# EAGLE design gm (EAGLE 9.6.2)
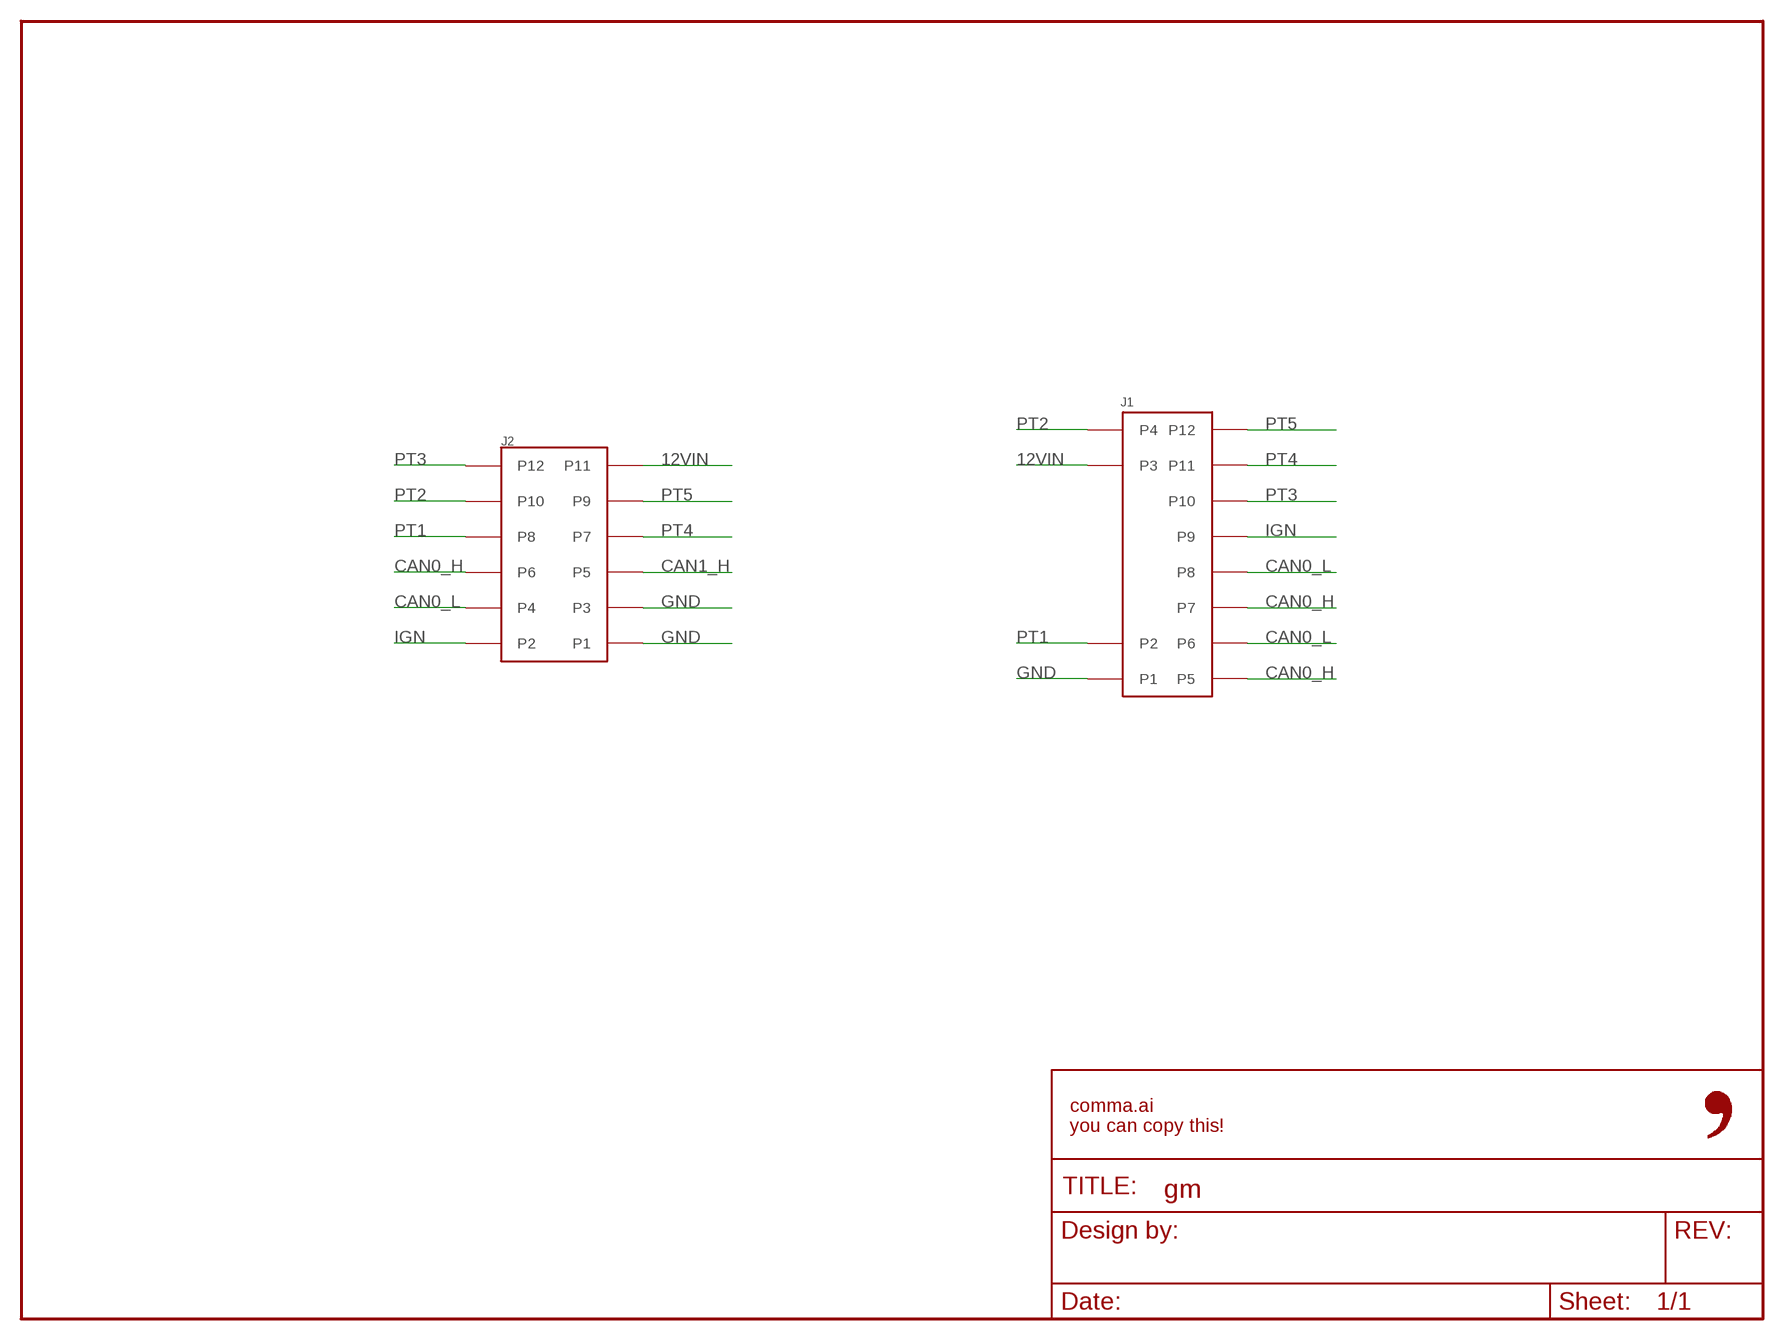
[diagram p0: schematic, sheet 1]

## Parts
FRAME1  FRAME-LETTER-OPENNO_PACKAGE  [DUMMY]
J1  0348260124  [0348260124]
J2  5018761240  [5018761240]

## Nets
12VIN: J1.P3 J2.P11
CAN0_H: J1.P5 J1.P7 J2.P6
CAN0_L: J1.P6 J1.P8 J2.P4
CAN1_H: J2.P5
GND: J1.P1 J2.P1 J2.P3
IGN: J1.P9 J2.P2
PT1: J1.P2 J2.P8
PT2: J1.P4 J2.P10
PT3: J1.P10 J2.P12
PT4: J1.P11 J2.P7
PT5: J1.P12 J2.P9

## Library data of the parts
FRAME1 = comma.ai:FRAME-LETTER-OPEN: Schematic Frame - Letter Standard 8.5x11 US Letter frame; DESIGNER: Nobody; VERSION: v01
J1 = 0348240124:0348260124; CPN: CAI-HARNESS-MOLEX-0348260124
J2 = comma.ai:5018761240; CPN: CAI-HARNESS-MOLEX-5018761240

## Board
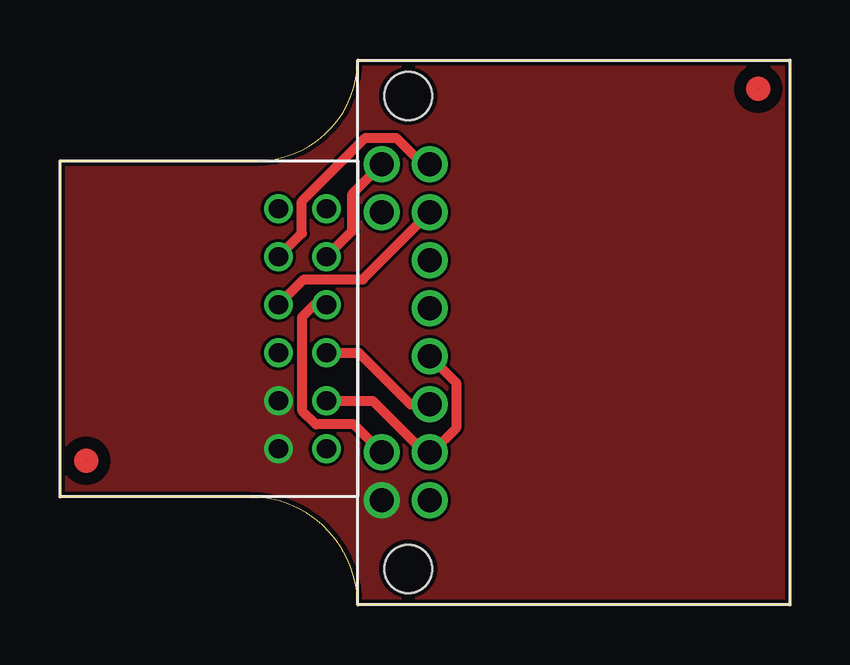
[diagram p1: board, top side]
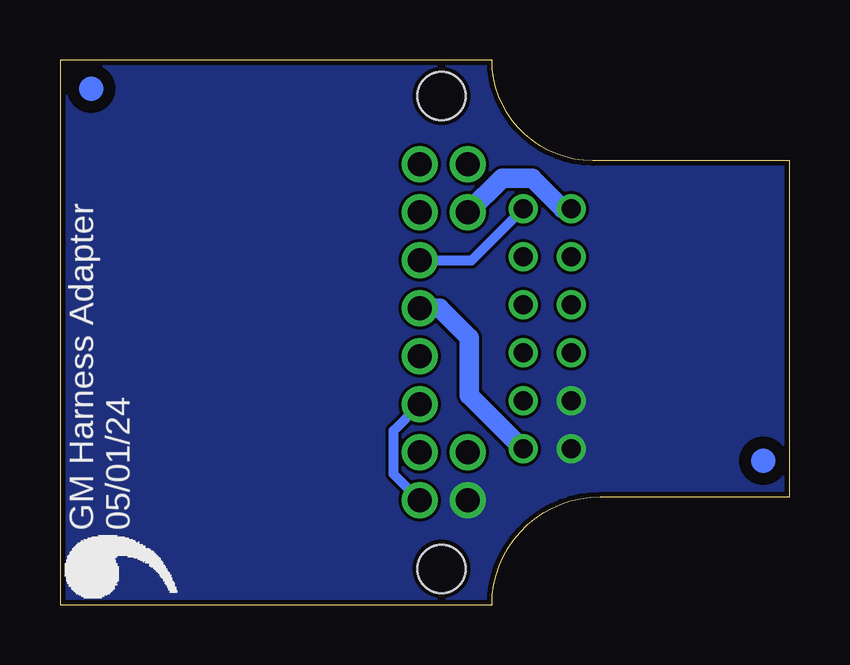
[diagram p2: board, bottom side, seen from below]

Size 30.4 x 22.7 mm. Coordinates in mm from the lower left corner, seen from the top.
Outline: 0,18.5 8.2,18.5 arc90 12.4,22.7 30.4,22.7 30.4,0 12.4,0 arc90 7.9,4.5 0,4.5 0,18.5
Copper layers (1*16): Top 0.035mm / dielectric 1.5mm / Bottom 0.035mm
Design rules "jlcpcb_2layer": minimum track width 5mil, minimum drill 12mil, track to track 5mil, track to pad 5mil, pad to pad 5mil, via to via 5mil, smd to smd 5mil, copper to edge 8mil, drill to drill 8mil, minimum pad ring 3mil, minimum via ring 3mil, stop-mask expansion 4mm, vias tented up to drill 20mil, thermal gap 10mil

### Footprints (pad centres in the part's own frame; a part is rotated, then mirrored left to right if it is on the bottom)
0348260124 = drill 1: P1 -7,2; P2 -5,2; P3 5,2; P4 7,2; P5 -7,0; P6 -5,0; P7 -3,0; P8 -1,0; P9 1,0; P10 3,0; P11 5,0; P12 7,0 | hole 2: -9.85,0.9; 9.85,0.9
5018761240 = drill 0.8: P1 5,-1; P2 5,1; P3 3,-1; P4 3,1; P5 1,-1; P6 1,1; P7 -1,-1; P8 -1,1; P9 -3,-1; P10 -3,1; P11 -5,-1; P12 -5,1

### Placement (x,y rotation side)
FRAME1  -0.92,-2.06 0 top
J1  15.41,11.35 90 top
J2  10.1,11.5 270 top
U$1  [LOGO]  25.21,-0.38 90 bottom
U$2  [FIDUCIAL]  29.1,21.5 0 top
U$3  [FIDUCIAL]  1.1,6 0 top

### Tracks (layer width: path | path; a pad name or v marks a point on that pad's centre or on a via)
12VIN
  Bottom 0.813: J2.P11 9.46,16.5 10.73,17.78 11.98,17.78 J1.P3
CAN0_H
  Top 0.406: J2.P6 12.45,10.5 14.6,8.35 J1.P7
  Bottom 0.406: J1.P5 16.5,5.44 16.5,7.26 J1.P7
CAN0_L
  Top 0.254: 15.49,6.35 J1.P6
  Top 0.406: J1.P8 16.5,9.26 16.5,7.36 15.49,6.35 | J2.P4 13.03,8.5 15.18,6.35 J1.P6
GND
  pour Top (no thermals): -1.31,24.02 31.69,24.02 31.69,-0.98 -1.31,-0.98
  pour Bottom (no thermals): -2.31,25.02 32.69,25.02 32.69,-1.98 -2.31,-1.98
IGN
  Bottom 0.813: J2.P2 11.12,6.5 13.35,8.73 13.35,11.13 14.57,12.35 J1.P9
PT1
  Top 0.406: J1.P2 12.24,7.52 10.66,7.52 10.1,8.07 10.1,12.01 10.59,12.5 J2.P8
PT2
  Top 0.406: J2.P10 12.18,15.58 12.18,17.12 J1.P4
PT3
  Bottom 0.406: J1.P10 13.25,14.35 J2.P12
PT4
  Top 0.406: J2.P7 10.16,13.56 12.62,13.56 J1.P11
PT5
  Top 0.305: 15.11,18.35 J1.P12
  Top 0.406: J2.P9 10.07,15.47 10.07,16.81 12.72,19.46 14,19.46 15.11,18.35

### Text on the board
bPlace: GM Harness Adapter / 05/01/24